# EAGLE design VDC (EAGLE 6.0)
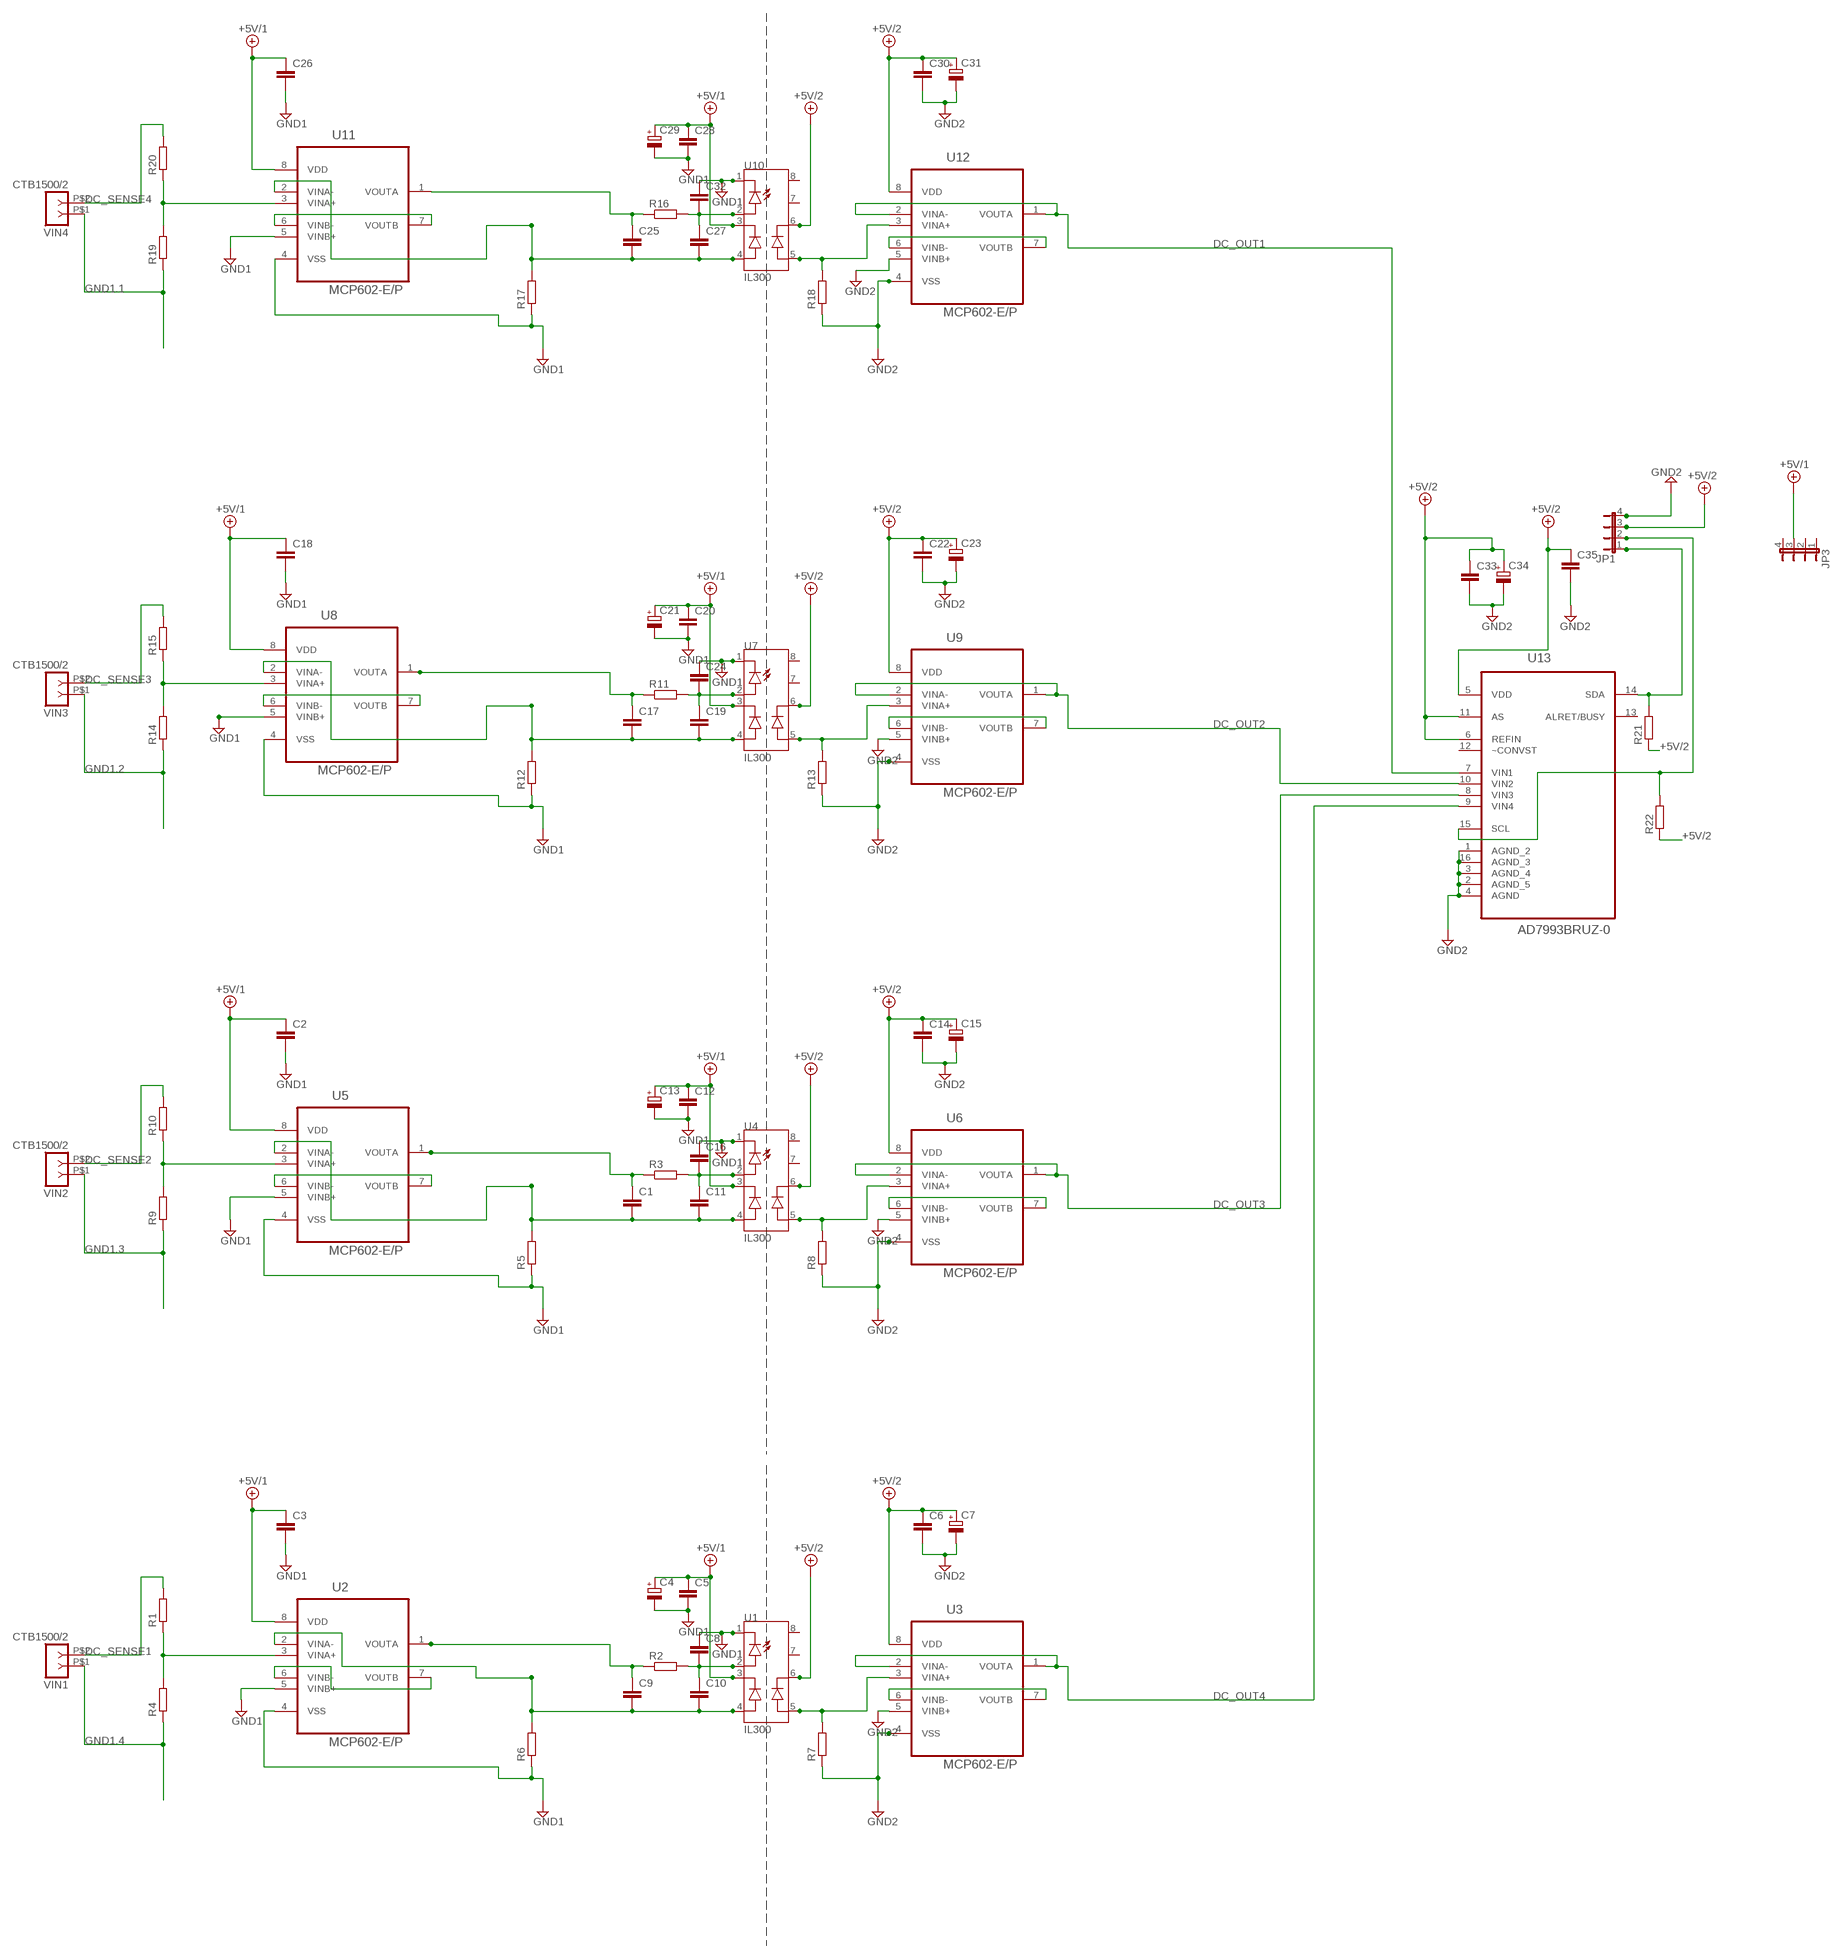
[diagram p0: schematic, sheet 1]

## Parts
C1  C-EU025-040X050  [C025-040X050]
C2  C-EU025-040X050  [C025-040X050]
C3  C-EU025-040X050  [C025-040X050]
C4  CPOL-EUE2-5  [E2-5]
C5  C-EU025-040X050  [C025-040X050]
C6  C-EU025-040X050  [C025-040X050]
C7  CPOL-EUE2-5  [E2-5]
C8  C-EU025-040X050  [C025-040X050]
C9  C-EU025-040X050  [C025-040X050]
C10  C-EU025-040X050  [C025-040X050]
C11  C-EU025-040X050  [C025-040X050]
C12  C-EU025-040X050  [C025-040X050]
C13  CPOL-EUE2-5  [E2-5]
C14  C-EU025-040X050  [C025-040X050]
C15  CPOL-EUE2-5  [E2-5]
C16  C-EU025-040X050  [C025-040X050]
C17  C-EU025-040X050  [C025-040X050]
C18  C-EU025-040X050  [C025-040X050]
C19  C-EU025-040X050  [C025-040X050]
C20  C-EU025-040X050  [C025-040X050]
C21  CPOL-EUE2-5  [E2-5]
C22  C-EU025-040X050  [C025-040X050]
C23  CPOL-EUE2-5  [E2-5]
C24  C-EU025-040X050  [C025-040X050]
C25  C-EU025-040X050  [C025-040X050]
C26  C-EU025-040X050  [C025-040X050]
C27  C-EU025-040X050  [C025-040X050]
C28  C-EU025-040X050  [C025-040X050]
C29  CPOL-EUE2-5  [E2-5]
C30  C-EU025-040X050  [C025-040X050]
C31  CPOL-EUE2-5  [E2-5]
C32  C-EU025-040X050  [C025-040X050]
C33  C-EU025-024X044  [C025-024X044]
C34  CPOL-EUE2-4  [E2-4]
C35  C-EU025-025X050  [C025-025X050]
JP1  JP4E  [JP4]
JP3  JP4E  [JP4]
R1  R-EU_0207/10  [0207/10]
R2  R-EU_0207/10  [0207/10]
R3  R-EU_0207/10  [0207/10]
R4  R-EU_0207/10  [0207/10]
R5  R-EU_0207/10  [0207/10]
R6  R-EU_0207/10  [0207/10]
R7  R-EU_0207/10  [0207/10]
R8  R-EU_0207/10  [0207/10]
R9  R-EU_0207/10  [0207/10]
R10  R-EU_0207/10  [0207/10]
R11  R-EU_0207/10  [0207/10]
R12  R-EU_0207/10  [0207/10]
R13  R-EU_0207/10  [0207/10]
R14  R-EU_0207/10  [0207/10]
R15  R-EU_0207/10  [0207/10]
R16  R-EU_0207/10  [0207/10]
R17  R-EU_0207/10  [0207/10]
R18  R-EU_0207/10  [0207/10]
R19  R-EU_0207/10  [0207/10]
R20  R-EU_0207/10  [0207/10]
R21  R-EU_0207/10  [0207/10]
R22  R-EU_0207/10  [0207/10]
U1  IL300  [DIL08]
U2  MCP602-E/P  [DIP254P762X508-8P]
U3  MCP602-E/P  [DIP254P762X508-8P]
U4  IL300  [DIL08]
U5  MCP602-E/P  [DIP254P762X508-8P]
U6  MCP602-E/P  [DIP254P762X508-8P]
U7  IL300  [DIL08]
U8  MCP602-E/P  [DIP254P762X508-8P]
U9  MCP602-E/P  [DIP254P762X508-8P]
U10  IL300  [DIL08]
U11  MCP602-E/P  [DIP254P762X508-8P]
U12  MCP602-E/P  [DIP254P762X508-8P]
U13  AD7993BRUZ-0  [SOP65P640X120-16N]
VIN1  CTB1500/2  [CTB1500-2]
VIN2  CTB1500/2  [CTB1500-2]
VIN3  CTB1500/2  [CTB1500-2]
VIN4  CTB1500/2  [CTB1500-2]

## Nets
+5V/1: C2.1 C3.1 C4.+ C5.1 C12.1 C13.+ C18.1 C20.1 C21.+ C26.1 C28.1 C29.+ JP3.3 U1.3(C_FB) U2.8(VDD) U4.3(C_FB) U5.8(VDD) U7.3(C_FB) U8.8(VDD) U10.3(C_FB) U11.8(VDD)
+5V/2: C6.1 C7.+ C14.1 C15.+ C22.1 C23.+ C30.1 C31.+ C33.1 C34.+ C35.1 JP1.3 R21.1 R22.1 U1.6(C_OUT) U3.8(VDD) U4.6(C_OUT) U6.8(VDD) U7.6(C_OUT) U9.8(VDD) U10.6(C_OUT) U12.8(VDD) U13.5(VDD) U13.6(REFIN) U13.11(AS)
DC_OUT1: U12.1(VOUTA) U12.2(VINA-) U13.7(VIN1)
DC_OUT2: U9.1(VOUTA) U9.2(VINA-) U13.10(VIN2)
DC_OUT3: U6.1(VOUTA) U6.2(VINA-) U13.8(VIN3)
DC_OUT4: U3.1(VOUTA) U3.2(VINA-) U13.9(VIN4)
DC_SENSE1: R1.2 VIN1.P$2
DC_SENSE2: R10.2 VIN2.P$2
DC_SENSE3: R15.2 VIN3.P$2
DC_SENSE4: R20.2 VIN4.P$2
GND1: C2.2 C3.2 C4.- C5.2 C8.1 C12.2 C13.- C16.1 C18.2 C20.2 C21.- C24.1 C26.2 C28.2 C29.- C32.1 R5.1 R6.1 R12.1 R17.1 U1.1(C_LED) U2.4(VSS) U2.5(VINB+) U4.1(C_LED) U5.4(VSS) U5.5(VINB+) U7.1(C_LED) U8.4(VSS) U8.5(VINB+) U10.1(C_LED) U11.4(VSS) U11.5(VINB+)
GND1.1: R19.1 VIN4.P$1
GND1.2: R14.1 VIN3.P$1
GND1.3: R9.1 VIN2.P$1
GND1.4: R4.1 VIN1.P$1
GND2: C6.2 C7.- C14.2 C15.- C22.2 C23.- C30.2 C31.- C33.2 C34.- C35.2 JP1.4 R7.1 R8.1 R13.1 R18.1 U3.4(VSS) U3.5(VINB+) U6.4(VSS) U6.5(VINB+) U9.4(VSS) U9.5(VINB+) U12.4(VSS) U12.5(VINB+) U13.1(AGND_2) U13.2(AGND_5) U13.3(AGND_4) U13.4(AGND) U13.16(AGND_3)
N$1: C9.2 C10.2 R6.2 U1.4(A_FB) U2.2(VINA-)
N$2: C1.2 C11.2 R5.2 U4.4(A_FB) U5.2(VINA-)
N$3: R7.2 U1.5(A_OUT) U3.3(VINA+)
N$4: C8.2 C10.1 R2.2 U1.2(A_LED)
N$5: C9.1 R2.1 U2.1(VOUTA)
N$6: C11.1 C16.2 R3.2 U4.2(A_LED)
N$7: C1.1 R3.1 U5.1(VOUTA)
N$8: R1.1 R4.2 U2.3(VINA+)
N$9: R8.2 U4.5(A_OUT) U6.3(VINA+)
N$10: R9.2 R10.1 U5.3(VINA+)
N$11: C17.2 C19.2 R12.2 U7.4(A_FB) U8.2(VINA-)
N$12: C19.1 C24.2 R11.2 U7.2(A_LED)
N$13: C17.1 R11.1 U8.1(VOUTA)
N$14: R13.2 U7.5(A_OUT) U9.3(VINA+)
N$15: R14.2 R15.1 U8.3(VINA+)
N$16: C25.2 C27.2 R17.2 U10.4(A_FB) U11.2(VINA-)
N$17: C27.1 C32.2 R16.2 U10.2(A_LED)
N$18: C25.1 R16.1 U11.1(VOUTA)
N$19: R18.2 U10.5(A_OUT) U12.3(VINA+)
N$20: R19.2 R20.1 U11.3(VINA+)
N$21: JP1.1 R21.2 U13.14(SDA)
N$22: JP1.2 R22.2 U13.15(SCL)
N$25: U11.6(VINB-) U11.7(VOUTB)
N$27: U12.6(VINB-) U12.7(VOUTB)
N$28: U8.6(VINB-) U8.7(VOUTB)
N$31: U9.6(VINB-) U9.7(VOUTB)
N$32: U5.6(VINB-) U5.7(VOUTB)
N$34: U6.6(VINB-) U6.7(VOUTB)
N$36: U2.6(VINB-) U2.7(VOUTB)
N$38: U3.6(VINB-) U3.7(VOUTB)
Unconnected: JP3.1 JP3.2 JP3.4 U1.7(PIN7) U1.8(PIN8) U4.7(PIN7) U4.8(PIN8) U7.7(PIN7) U7.8(PIN8) U10.7(PIN7) U10.8(PIN8) U13.12(~CONVST) U13.13(ALRET/BUSY)

## Library data of the parts
C1-C3 C5 C6 C8-C12 C14 C16-C20 C22 C24-C28 C30 C32 C33 C35 = resistor:C-EU: CAPACITOR, European symbol
C4 C7 C13 C15 C21 C23 C29 C31 C34 = resistor:CPOL-EU: POLARIZED CAPACITOR, European symbol
JP1 JP3 = jumper:JP4E: JUMPER
R1-R22 = resistor:R-EU_: RESISTOR, European symbol
U1 U4 U7 U10 = ic-optoisolator:IL300
U2 U3 U5 U6 U8 U9 U11 U12 = MCP:MCP602-E/P: IC, 2.7V to 5.5V Single-Supply CMOS Dual Op Amps,DIP-8; MPN: MCP602-E/P; OC_FARNELL: 1852042; OC_NEWARK: 88H9870; PACKAGE: DIP-8; SUPPLIER: Microchip
U13 = ADC:AD7993BRUZ-0: ADC; MPN: AD7993BRUZ-0; OC_FARNELL: 1078309; OC_NEWARK: 59K6101; PACKAGE: TSSOP-16; SUPPLIER: Analog Devices
VIN1-VIN4 = eko-parts:CTB1500/2

## Board
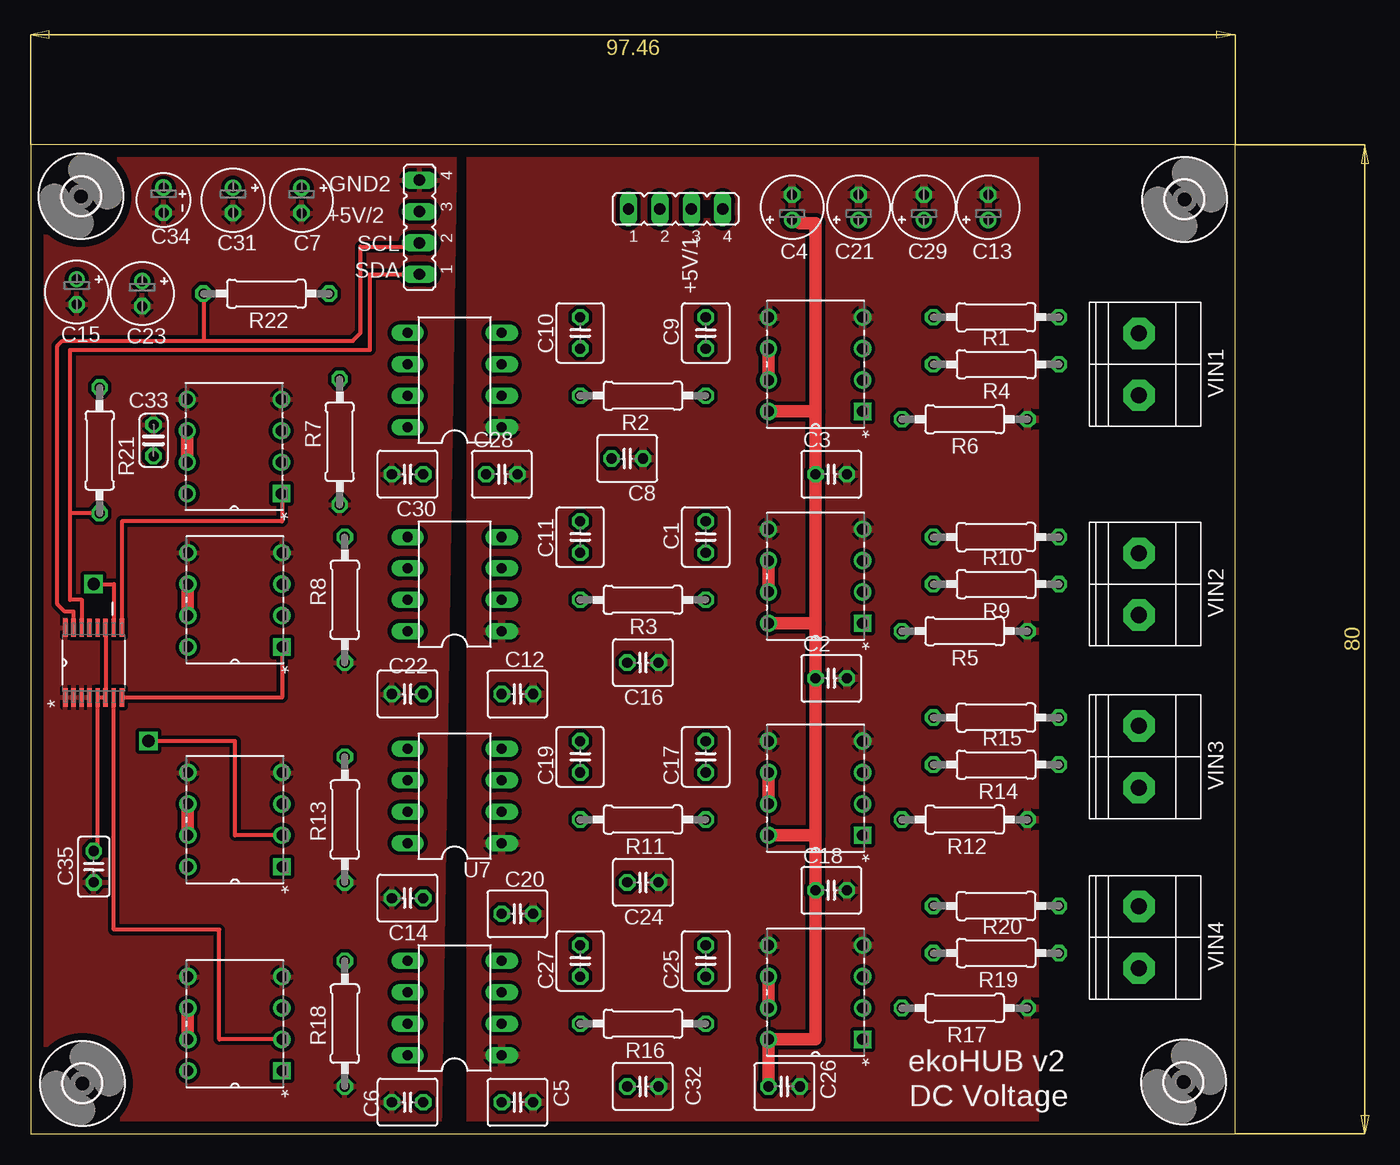
[diagram p1: board, top side]
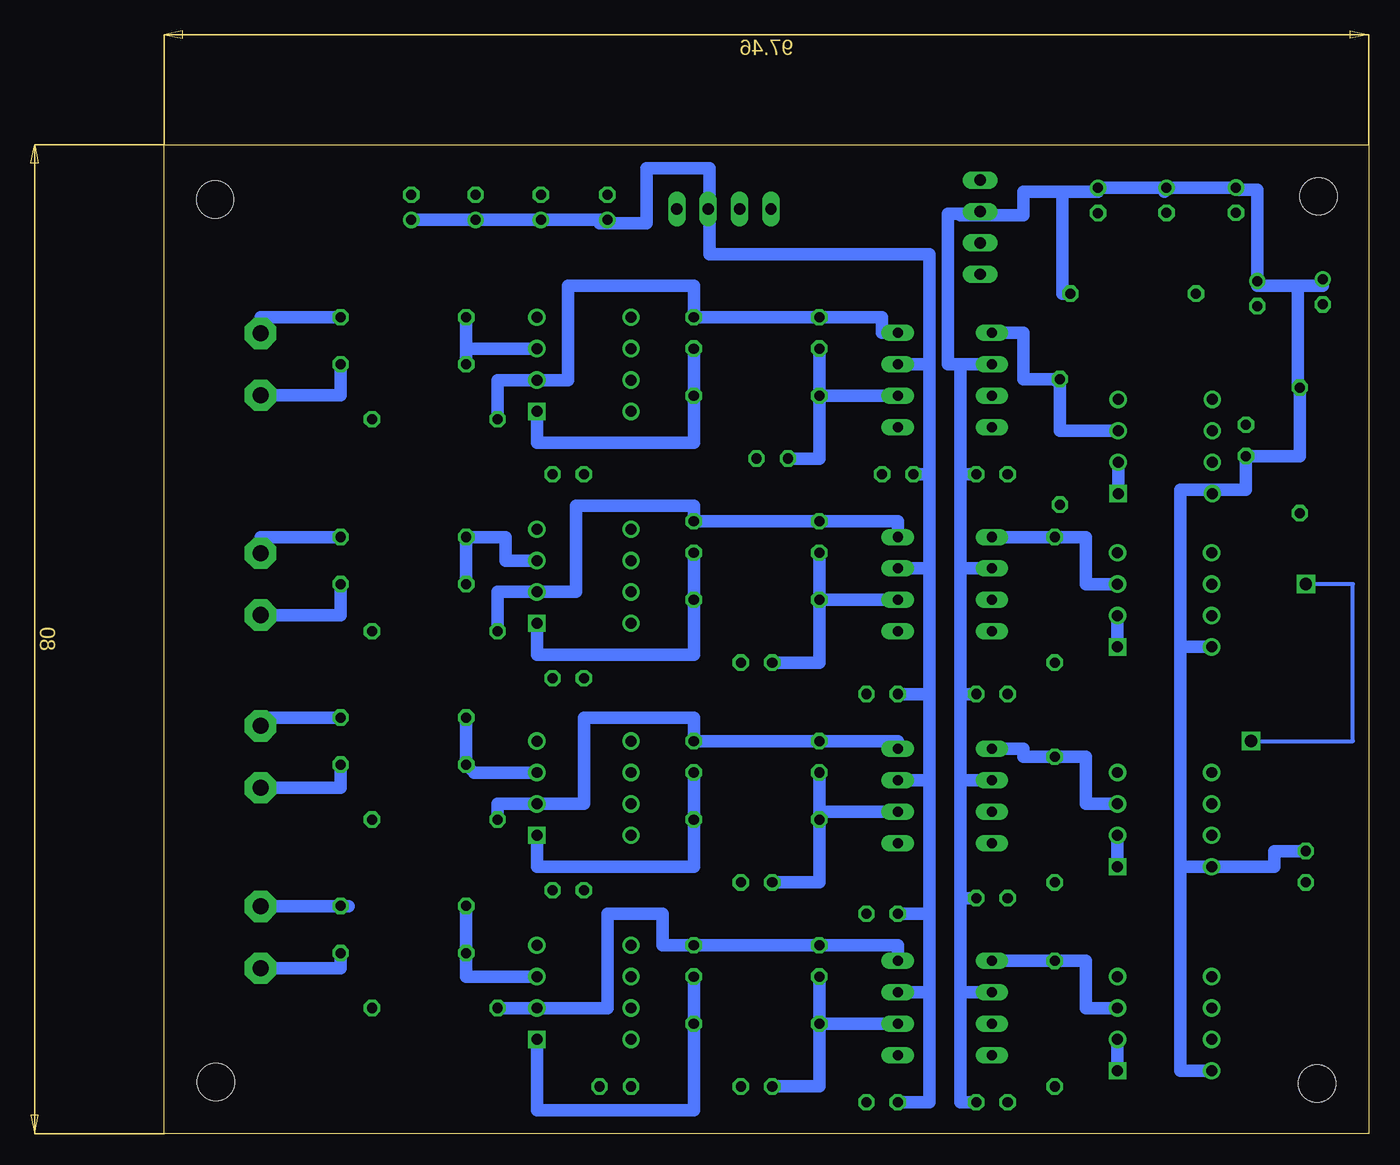
[diagram p2: board, bottom side, seen from below]

Size 97.46 x 80 mm. Coordinates in mm from the lower left corner, seen from the top.
Outline: 0,0 97.46,0 97.46,80 0,80 0,0
Copper layers (1*16): Top 0.035mm / dielectric 1.5mm / Bottom 0.035mm
Design rules: minimum track width 10mil, minimum drill 24mil, track to track 12mil, track to pad 12mil, pad to pad 12mil, via to via 12mil, smd to smd 12mil, copper to edge 40mil, drill to drill 8mil, minimum pad ring 10mil, minimum via ring 8mil, stop-mask expansion 4mil, vias tented up to drill 0mil, thermal gap 10mil

### Footprints (pad centres in the part's own frame; a part is rotated, then mirrored left to right if it is on the bottom)
C025-040X050 = drill 0.813 octagon: 1 -1.27,0; 2 1.27,0
E2-5 = drill 0.813 pad 1.27: + -1.016,0 | drill 0.813 pad 1.27 octagon: - 1.016,0
C025-024X044 = drill 0.813 octagon: 1 -1.27,0; 2 1.27,0
E2-4 = drill 0.813 pad 1.27: + -1.016,0 | drill 0.813 pad 1.27 octagon: - 1.016,0
C025-025X050 = drill 0.813 octagon: 1 -1.27,0; 2 1.27,0
JP4 = drill 0.914 long: 1 -3.81,0; 2 -1.27,0; 3 1.27,0; 4 3.81,0
0207/10 = drill 0.813 octagon: 1 -5.08,0; 2 5.08,0
DIL08 = drill 0.813 long: 1 -3.81,-3.81; 2 -1.27,-3.81; 3 1.27,-3.81; 4 3.81,-3.81; 5 3.81,3.81; 6 1.27,3.81; 7 -1.27,3.81; 8 -3.81,3.81
DIP254P762X508-8P = drill 0.889 square: 1 -7.62,7.62 | drill 0.889: 2 -7.62,5.08; 3 -7.62,2.54; 4 -7.62,0; 5 0,0; 6 0,2.54; 7 0,5.08; 8 0,7.62
SOP65P640X120-16N = smd 1.473 x 0.356: 1 -2.819,2.286; 2 -2.819,1.626; 3 -2.819,0.965; 4 -2.819,0.33; 5 -2.819,-0.33; 6 -2.819,-0.965; 7 -2.819,-1.626; 8 -2.819,-2.286; 9 2.819,-2.286; 10 2.819,-1.626; 11 2.819,-0.965; 12 2.819,-0.33; 13 2.819,0.33; 14 2.819,0.965; 15 2.819,1.626; 16 2.819,2.286
3,0 = hole 3: 0,0
CTB1500-2 = drill 1.3 pad 2.54 octagon: P$1 -2.5,0.5; P$2 2.5,0.5

### Placement (x,y rotation side)
C1  54.61,48.26 90 top
C2  64.77,36.83 0 top
C3  64.77,53.34 0 top
C4  61.59,74.93 90 top
C5  39.37,2.54 0 top
C6  30.48,2.54 180 top
C7  21.89,75.48 270 top
C8  48.26,54.61 180 top
C9  54.61,64.77 90 top
C10  44.45,64.77 90 top
C11  44.45,48.26 90 top
C12  39.37,35.56 0 top
C13  77.47,74.93 90 top
C14  30.48,19.05 180 top
C15  3.71,68.09 270 top
C16  49.53,38.1 180 top
C17  54.61,30.48 90 top
C18  64.77,19.68 0 top
C19  44.45,30.48 90 top
C20  39.37,17.78 0 top
C21  66.98,74.93 90 top
C22  30.48,35.56 180 top
C23  9.01,67.95 270 top
C24  49.53,20.32 180 top
C25  54.61,13.97 90 top
C26  60.96,3.81 0 top
C27  44.45,13.97 90 top
C28  38.1,53.34 0 top
C29  72.26,74.93 90 top
C30  30.48,53.34 180 top
C31  16.35,75.5 270 top
C32  49.53,3.81 180 top
C33  9.92,56.08 90 top
C34  10.74,75.51 270 top
C35  5.08,21.59 270 top
JP1  31.44,73.32 90 top
JP3  52.17,74.79 0 top
R1  78.11,66.04 0 top
R2  49.53,59.69 180 top
R3  49.53,43.18 180 top
R4  78.11,62.23 180 top
R5  75.56,40.64 180 top
R6  75.56,57.78 180 top
R7  24.99,55.96 90 top
R8  25.4,43.18 90 top
R9  78.11,44.45 180 top
R10  78.11,48.26 0 top
R11  49.53,25.4 180 top
R12  75.56,25.4 180 top
R13  25.4,25.4 90 top
R14  78.11,29.84 180 top
R15  78.11,33.66 0 top
R16  49.53,8.89 180 top
R17  75.56,10.16 180 top
R18  25.4,8.89 90 top
R19  78.11,14.61 180 top
R20  78.11,18.41 0 top
R21  5.56,55.27 270 top
R22  19.05,67.94 180 top
U1  34.29,60.96 90 top
U2  59.69,66.04 180 top
U3  12.64,59.39 180 top
U4  34.29,44.45 90 top
U5  59.69,48.9 180 top
U6  12.7,46.99 180 top
U7  34.29,27.3 90 top
U8  59.69,31.75 180 top
U9  12.7,29.21 180 top
U10  34.29,10.16 90 top
U11  59.69,15.24 180 top
U12  12.7,12.7 180 top
U13  5.08,38.1 90 top
U$1  [3,0]  4.17,4.06 0 top
U$2  [3,0]  93.34,75.56 0 top
U$3  [3,0]  93.27,4.17 0 top
U$4  [3,0]  4.06,75.82 0 top
VIN1  90.17,62.23 90 top
VIN2  90.17,44.45 90 top
VIN3  90.17,30.48 90 top
VIN4  90.17,15.88 90 top

### Tracks (layer width: path | path; a pad name or v marks a point on that pad's centre or on a via)
+5V/1
  Top 1.016: 63.5,24.13 C18.1 63.5,7.62 U11.8 C26.1 | 63.5,24.13 U8.8 | 63.5,24.13 C2.1 63.5,41.27 | 63.5,41.27 C3.1 63.5,58.42 | 63.5,58.42 63.5,73.66 62.23,73.66 C4.+ | U2.8 63.5,58.42 | U5.8 63.5,41.27
  Bottom 1.016: C5.1 35.56,2.54 35.56,11.43 | U10.3 35.56,11.43 | 35.56,11.43 35.56,17.78 | C20.1 35.56,17.78 | 35.56,17.78 35.56,28.57 | 35.56,35.56 35.56,45.72 | 35.56,53.34 35.56,62.23 | 35.56,62.23 35.56,71.12 53.34,71.12 53.34,74.15 | C28.1 35.56,53.34 | 35.56,53.34 35.56,45.72 | 35.56,45.72 U4.3 | U7.3 35.56,28.57 | 35.56,28.57 35.56,35.56 | 35.56,35.56 C12.1 | U1.3 35.56,62.23 | 53.34,74.3 53.44,74.3 JP3.3 53.34,74.15 | 53.34,74.15 53.34,74.3 | 53.34,74.3 53.34,78.11 58.42,78.11 58.42,73.66 62.23,73.66 C4.+ C21.+ C29.+ C13.+
+5V/2
  Top 0.305: C35.1 5.41,22.86 U13.5 U13.6 U13.11
  Bottom 1.016: 33.02,53.34 33.02,45.72 | 33.02,45.72 U4.6 | 33.02,45.72 33.02,35.56 | C22.1 33.02,35.56 | 33.02,35.56 33.02,28.57 | 33.02,28.57 33.02,19.05 | 33.02,19.05 C14.1 | U7.6 33.02,28.57 | C30.1 33.02,53.34 | C6.1 33.02,2.54 33.02,11.43 | U10.6 33.02,11.43 | 33.02,11.43 33.02,19.05 | U12.8 15.24,5.08 15.24,21.59 | 15.24,21.59 U9.8 7.62,21.59 7.62,22.86 C35.1 | 15.24,39.37 15.24,21.59 | U6.8 15.24,39.37 | 33.02,53.34 33.02,62.23 | 32.38,74.3 30.8,74.3 JP1.3 31.44,74.3 27.94,74.3 27.94,76.2 24.77,76.2 | U1.6 33.02,62.23 | 15.24,39.37 15.24,52.07 12.64,52.07 | 12.64,52.07 U3.8 | 9.01,68.91 C23.+ | 3.71,68.97 C15.+ 3.71,68.58 5.71,68.58 | 33.02,62.23 34.04,62.23 34.04,74.42 32.38,74.42 32.38,74.3 | 32.38,74.3 33.02,74.3 | 12.64,52.07 9.92,52.07 C33.1 5.56,54.81 R21.1 5.71,60.35 5.71,68.58 | 5.71,68.58 9.01,68.58 C23.+ | C23.+ 8.99,68.97 8.99,76.35 10.74,76.35 C34.+ 16.51,76.53 16.51,76.51 | 16.51,76.51 16.51,76.2 | 16.51,76.51 C31.+ 21.89,76.51 C7.+ 21.89,76.2 24.77,76.2 | R22.1 24.77,67.94 24.77,76.2
DC_OUT1
  Top 0.305: U12.2 15.24,7.62 15.24,16.51 6.71,16.51 U13.7
  Bottom 1.016: U12.2 U12.1
DC_OUT2  (via drill 1)
  Top 0.305: U9.2 16.51,24.13 16.51,31.75 v9.53,31.75 | v5.08,44.45 6.71,44.45 U13.10
  Bottom 0.305: v9.53,31.75 1.27,31.75 1.27,44.45 v5.08,44.45
  Bottom 1.016: U9.2 U9.1
DC_OUT3
  Top 0.305: U6.1 20.32,35.28 U13.8
  Bottom 1.016: U6.1 U6.2
DC_OUT4
  Top 0.305: U3.1 20.32,51.77 20.32,49.53 7.37,49.53 7.37,41.15 U13.9 7.37,40.64
  Bottom 1.016: U3.1 U3.2
DC_SENSE1
  Bottom 1.016: R1.2 89.67,66.04 VIN1.P$2
DC_SENSE2
  Bottom 1.016: R10.2 89.67,48.26 VIN2.P$2
DC_SENSE3
  Bottom 1.016: R15.2 89.67,33.66 VIN3.P$2
DC_SENSE4
  Bottom 1.016: VIN4.P$2 82.55,18.38 R20.2
GND1
  pour Top: 35.56,80.01 81.28,80.01 81.28,0 35.56,0
GND1.1
  Bottom 1.016: VIN4.P$1 83.19,13.38 R19.1
GND1.2
  Bottom 1.016: VIN3.P$1 83.19,27.98 R14.1
GND1.3
  Bottom 1.016: VIN2.P$1 83.19,41.95 R9.1
GND1.4
  Bottom 1.016: VIN1.P$1 83.19,59.73 R4.1
GND2
  pour Top: 0,80.01 34.29,80.01 33.02,0 0,0
N$1
  Bottom 1.016: R6.2 70.48,60.96 U2.2 64.77,60.96 64.77,68.58 54.61,68.58 C9.2 C10.2 39.37,66.04 39.37,64.77 U1.4
N$2
  Bottom 1.016: R5.2 70.48,43.81 U5.2 64.14,43.81 64.14,50.8 54.61,50.8 C1.2 C11.2 38.1,49.53 U4.4
N$3
  Bottom 1.016: U3.3 24.99,56.85 R7.2 25.4,61.04 | 25.4,61.04 25.4,60.96 | 25.4,61.04 27.94,61.04 27.94,64.77 U1.5
N$4
  Bottom 1.016: 44.45,60.96 R2.2 | R2.2 C10.1 | R2.2 44.45,54.61 C8.2 | U1.2 R2.2
N$5
  Bottom 1.016: C9.1 R2.1 54.61,55.88 67.31,55.88 U2.1
N$6
  Bottom 1.016: R3.2 C11.1 | R3.2 U4.2 | R3.2 44.45,38.1 C16.2
N$7
  Bottom 1.016: C1.1 R3.1 54.61,38.73 67.31,38.73 U5.1
N$8
  Bottom 1.016: R1.1 73.03,63.5 | 73.03,63.5 R4.2 | U2.3 73.03,63.5
N$9
  Bottom 1.016: U4.5 R8.2 22.86,48.26 22.86,44.45 U6.3
N$10
  Bottom 1.016: R9.2 R10.1 69.85,48.26 69.85,46.35 U5.3
N$11
  Bottom 1.016: U7.4 38.1,31.75 C19.2 C17.2 54.61,33.66 63.5,33.66 63.5,26.67 U8.2 70.48,26.67 R12.2
N$12
  Bottom 1.016: U7.2 44.45,26.04 R11.2 | R11.2 C19.1 | R11.2 44.45,20.32 C24.2
N$13
  Bottom 1.016: C17.1 R11.1 54.61,21.59 67.31,21.59 U8.1
N$14
  Bottom 1.016: U9.3 22.86,26.67 22.86,30.48 R13.2 27.94,30.48 27.94,31.11 U7.5
N$15
  Bottom 1.016: U8.3 72.39,29.21 R14.2 R15.1
N$16
  Bottom 1.016: U10.4 38.1,15.24 C27.2 C25.2 57.15,15.24 57.15,17.78 61.59,17.78 61.59,10.16 U11.2 R17.2
N$17
  Bottom 1.016: R16.2 U10.2 | R16.2 C27.1 | R16.2 44.45,3.81 C32.2
N$18
  Bottom 1.016: C25.1 R16.1 54.61,1.91 67.31,1.91 U11.1
N$19
  Bottom 1.016: U10.5 R18.2 22.86,13.97 22.86,10.16 U12.3
N$20
  Bottom 1.016: R20.1 R19.2 73.03,12.7 U11.3
N$21
  Top 0.305: U13.14 4.12,43.18 3.18,43.18 | 3.18,43.18 3.18,63.41 27.44,63.41 27.44,69.5 30.78,69.5 | 30.78,69.5 30.89,69.5 30.89,69.32 | JP1.1 30.78,69.51 30.78,69.5 | R21.2 3.17,50.19 3.17,43.18 3.18,43.18
N$22
  Top 0.305: U13.15 3.45,42.19 3.43,42.22 2.74,42.22 2.13,42.82 2.13,63.73 2.54,64.14 13.97,64.14 | 13.97,64.14 26.04,64.14 26.67,64.77 26.67,71.75 31.42,71.75 31.42,71.88 31.44,71.88 JP1.2 | R22.2 13.97,64.14
N$25
  Top 1.016: U11.7 U11.6
N$27
  Top 1.016: U12.7 U12.6
N$28
  Top 1.016: U8.7 U8.6
N$31
  Top 1.016: U9.7 U9.6
N$32
  Top 1.016: U5.7 U5.6
N$34
  Top 1.016: U6.7 U6.6
N$36
  Top 1.016: U2.7 U2.6
N$38
  Top 1.016: U3.7 U3.6

### Text on the board
tPlace: GND2 | +5V/2 | SCL | SDA | +5V/1 | ekoHUB v2 | DC Voltage